# EAGLE design shuntmonitor (EAGLE 7.2.0)
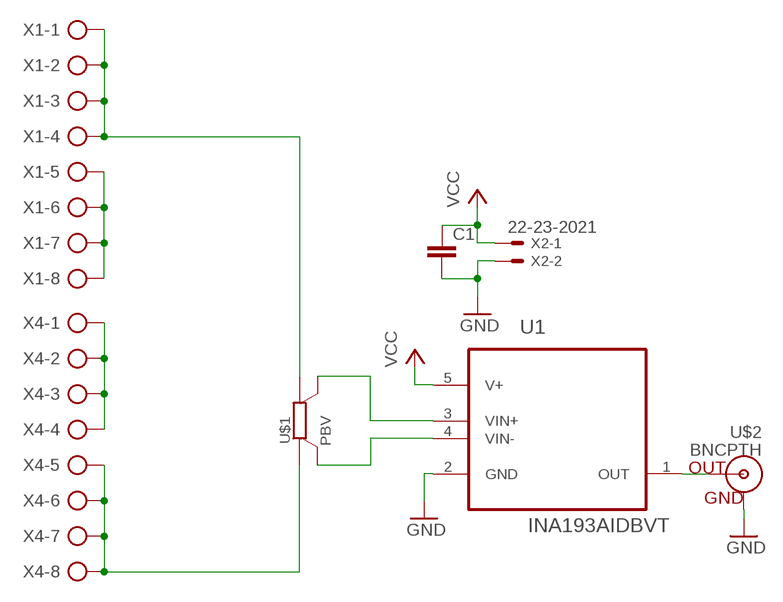
[diagram p0: schematic, sheet 1]

## Parts
C1  C-EUC0805  [C0805]
U1  INA193AIDBVT  [SOT95P280X145-5N]
U$1  PBV  [PBV]
U$2  BNCPTH  [BNC]
X1  AK500/8  [AK500/8]
X2  22-23-2021  [22-23-2021]
X4  AK500/8  [AK500/8]

## Nets
GND: C1.2 U1.2(GND) U$2.GND X2.2
N$1: X4.1 X4.2 X4.3 X4.4
N$2: U1.1(OUT) U$2.S(OUT)
N$3: U1.4(VIN-) U$1.U2(SB)
N$4: U1.3(VIN+) U$1.U1(SA)
N$9: U$1.I2(B) X4.5 X4.6 X4.7 X4.8
N$10: X1.5 X1.6 X1.7 X1.8
N$12: U$1.I1(A) X1.1 X1.2 X1.3 X1.4
VCC: C1.1 U1.5(V+) X2.1

## Library data of the parts
C1 = rcl:C-EU: CAPACITOR, European symbol
U1 = Texas Instruments_By_element14_Batch_1:INA193AIDBVT: CURRENT SHUNT MONITOR -16V to +80V Common-Mode Range; MPN: INA193AIDBVT; OC_FARNELL: 1564940; OC_NEWARK: 21J8780; PACKAGE: SOT-23-5; SUPPLIER: Texas Instruments
U$1 = isabellen:PBV
U$2 = SparkFun-Connectors:BNC: BNC Connector, Mouser Part# 5227161
X1 X4 = con-ptr500:AK500/8: CONNECTOR; OC_FARNELL: unknown; OC_NEWARK: unknown
X2 = con-molex:22-23-2021: .100" (2.54mm) Center Header - 2 Pin; MF: MOLEX; MPN: 22-23-2021; OC_FARNELL: 1462926; OC_NEWARK: 25C3832

## Board
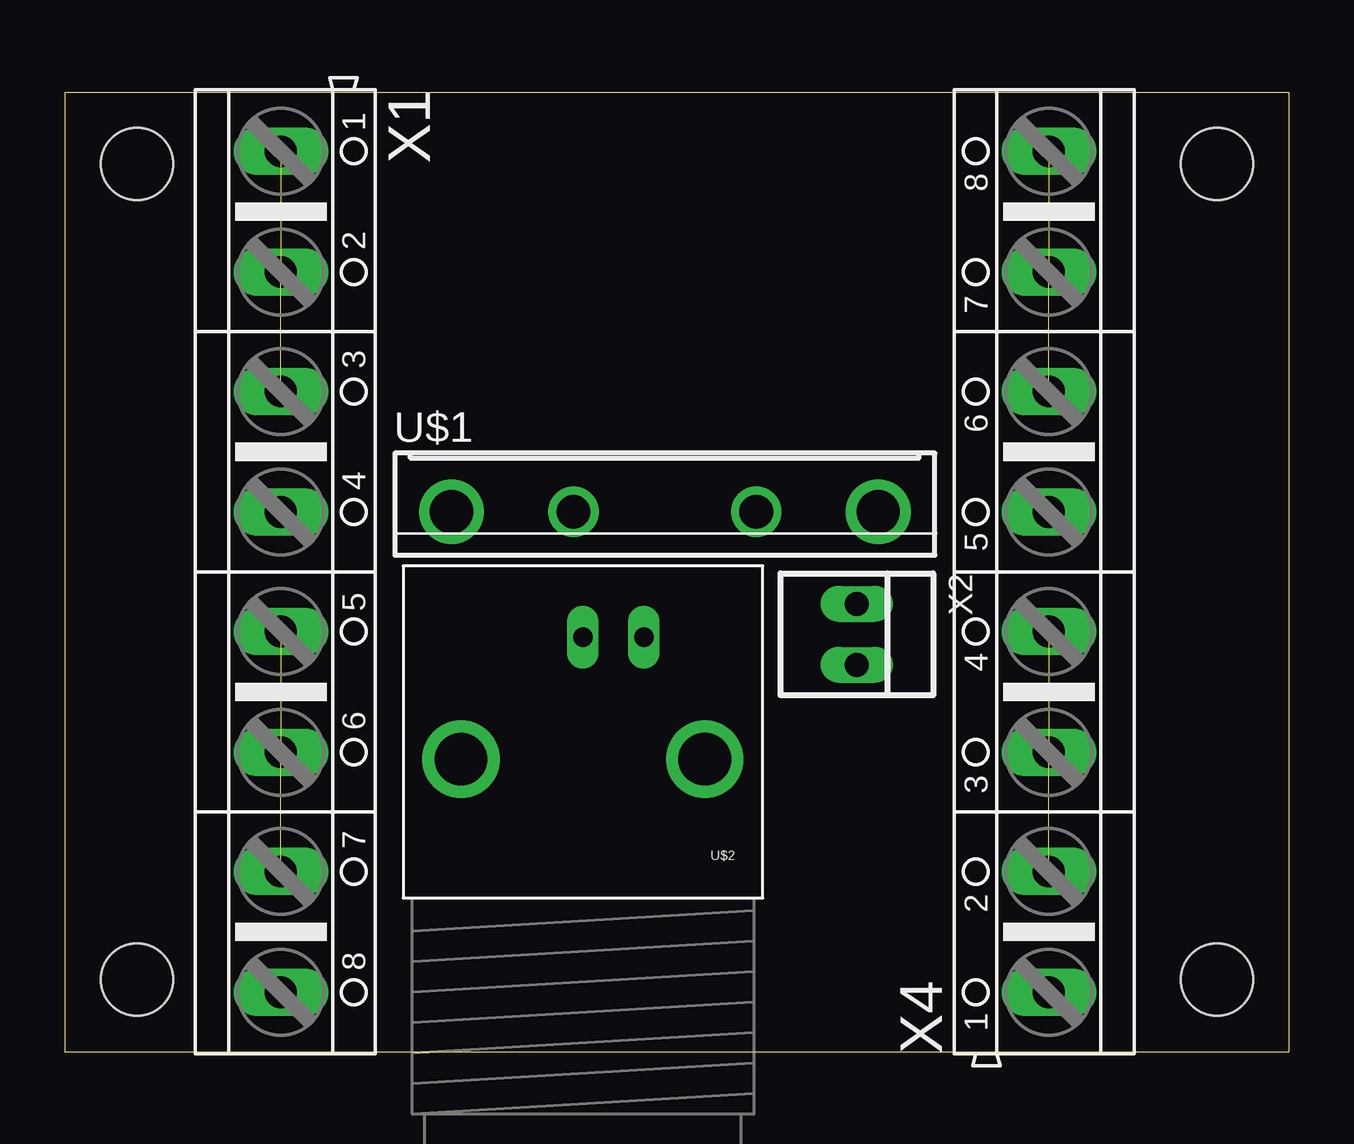
[diagram p1: board, top side]
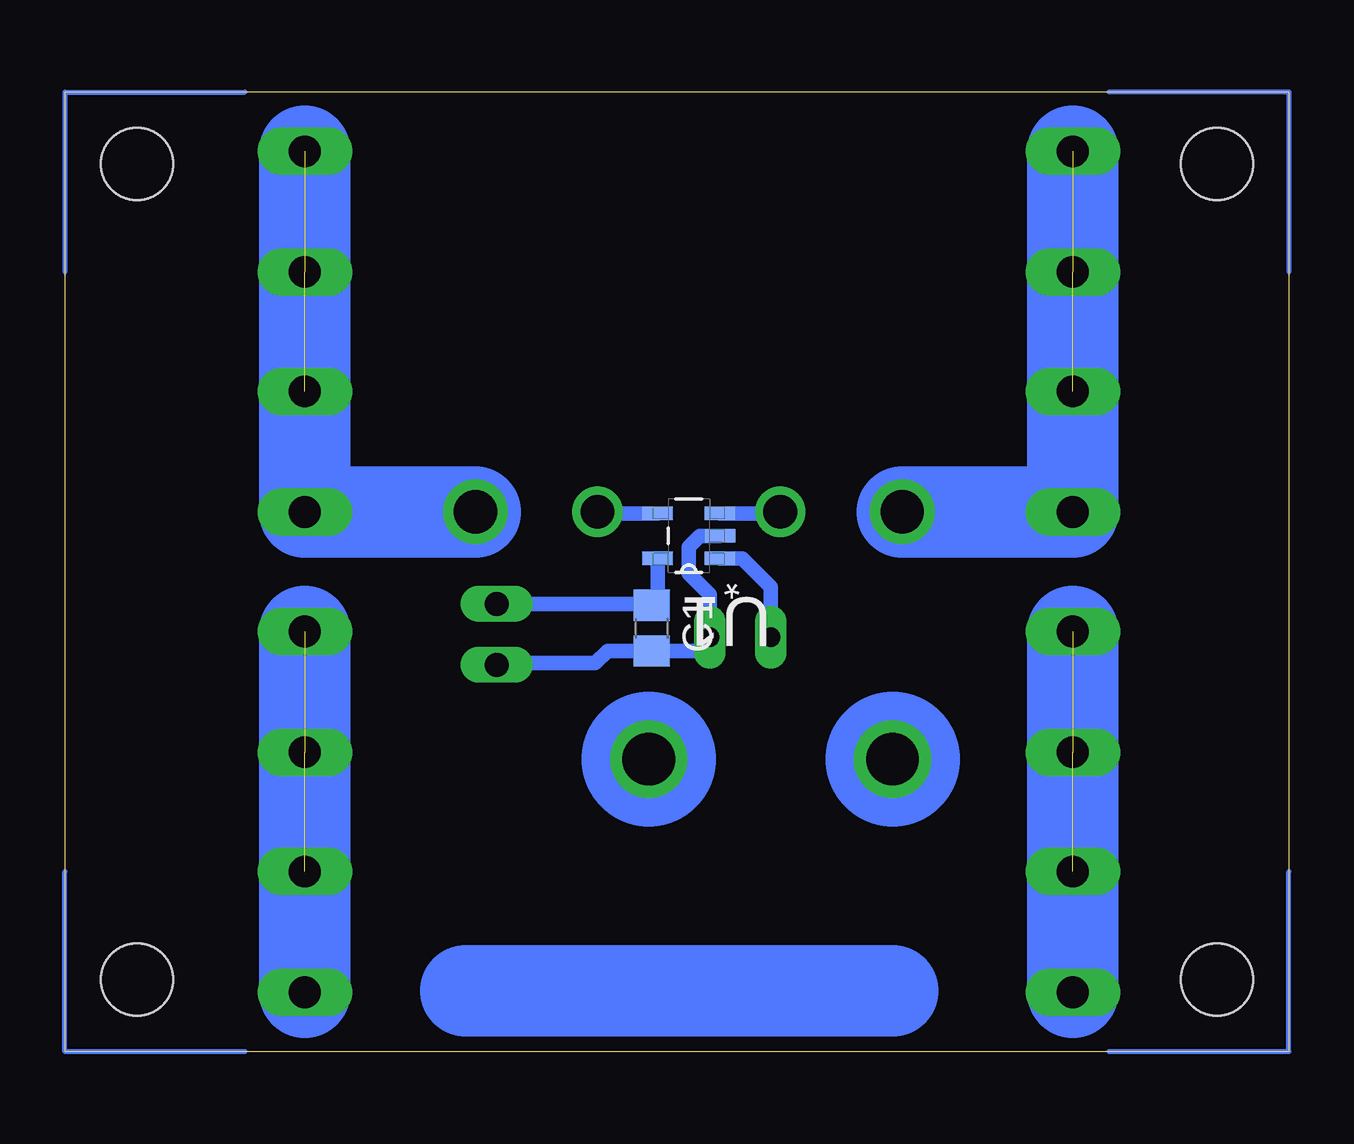
[diagram p2: board, bottom side, seen from below]

Size 51 x 40 mm. Coordinates in mm from the lower left corner, seen from the top.
Outline: 0,0 51,0 51,40 0,40 0,0
Copper layers (1*16): Top 0.035mm / dielectric 1.5mm / Bottom 0.035mm
Design rules "default *": minimum track width 10mil, minimum drill 24mil, track to track 8mil, track to pad 8mil, pad to pad 8mil, via to via 8mil, smd to smd 8mil, copper to edge 40mil, drill to drill 8mil, minimum pad ring 10mil, minimum via ring 8mil, stop-mask expansion 4mil, vias tented up to drill 0mil, thermal gap 10mil
Holes 3 mm at 3,3 3,3 48,3 48,37 3,37

### Footprints (pad centres in the part's own frame; a part is rotated, then mirrored left to right if it is on the bottom)
C0805 = smd 1.3 x 1.5: 1 -0.95,0; 2 0.95,0
SOT95P280X145-5N = smd 1.27 x 0.559: 1 -1.295,0.94; 2 -1.295,0; 3 -1.295,-0.94; 4 1.295,-0.94; 5 1.295,0.94
PBV = drill 1.8: I1 -8.89,0; I2 8.89,0 | drill 1.4: U1 -3.81,0; U2 3.81,0
BNC = drill 2.2: 3 -5.08,5.08; 4 5.08,5.08 | drill 0.8 long: GND -2.54,0; S 0,0
AK500/8 = drill 1.321 long: 1 -17.526,0; 2 -12.497,0; 3 -7.518,0; 4 -2.489,0; 5 2.489,0; 6 7.518,0; 7 12.497,0; 8 17.526,0
22-23-2021 = drill 1 long: 1 -1.27,0; 2 1.27,0

### Placement (x,y rotation side)
C1  26.54,17.65 270 bottom
U1  25,21.5 180 bottom
U$1  25,22.5 0 top
U$2  21.59,17.27 180 top
X1  9,20 270 top
X2  33,17.39 270 top
X4  41,20 90 top

### Tracks (layer width: path | path; a pad name or v marks a point on that pad's centre or on a via)
GND
  Bottom 0.61: X2.2 32.93,16.19 28.89,16.19 28.38,16.7 C1.2 24.7,16.7 U$2.GND 24.13,19.05 25,19.92 25,21.03 24.54,21.5 U1.2
N$1  (2 unrouted)
  Bottom 3.81: X4.4 X4.1
N$2
  Bottom 0.61: U1.1 22.78,20.56 21.59,19.37 U$2.S
N$3
  Bottom 0.61: U1.4 28.75,22.44 U$1.U2
N$4
  Bottom 0.61: U1.3 21.25,22.44 U$1.U1
N$5
  Bottom 0.2: 7.5,40 0,40 0,32.5
N$6
  Bottom 0.2: 43.5,40 51,40 51,32.5
N$7
  Bottom 0.2: 0,7.5 0,0 7.5,0
N$8
  Bottom 0.2: 43.5,0 51,0 51,7.5
N$9  (2 unrouted)
  Bottom 3.81: X4.8 X4.5 U$1.I2
N$10  (2 unrouted)
  Bottom 3.81: X1.5 X1.8
N$11
  Bottom 3.81: 16.51,2.54 34.29,2.54
N$12  (2 unrouted)
  Bottom 3.81: X1.1 X1.4 U$1.I1
VCC
  Bottom 0.61: U1.5 26.3,18.85 C1.1 26.6,18.66 X2.1
(copper drawn outside any net)
  shapes: Bottom circle x2